# Altium schematic sheet XMOD_Thermal.SchDoc
size A4
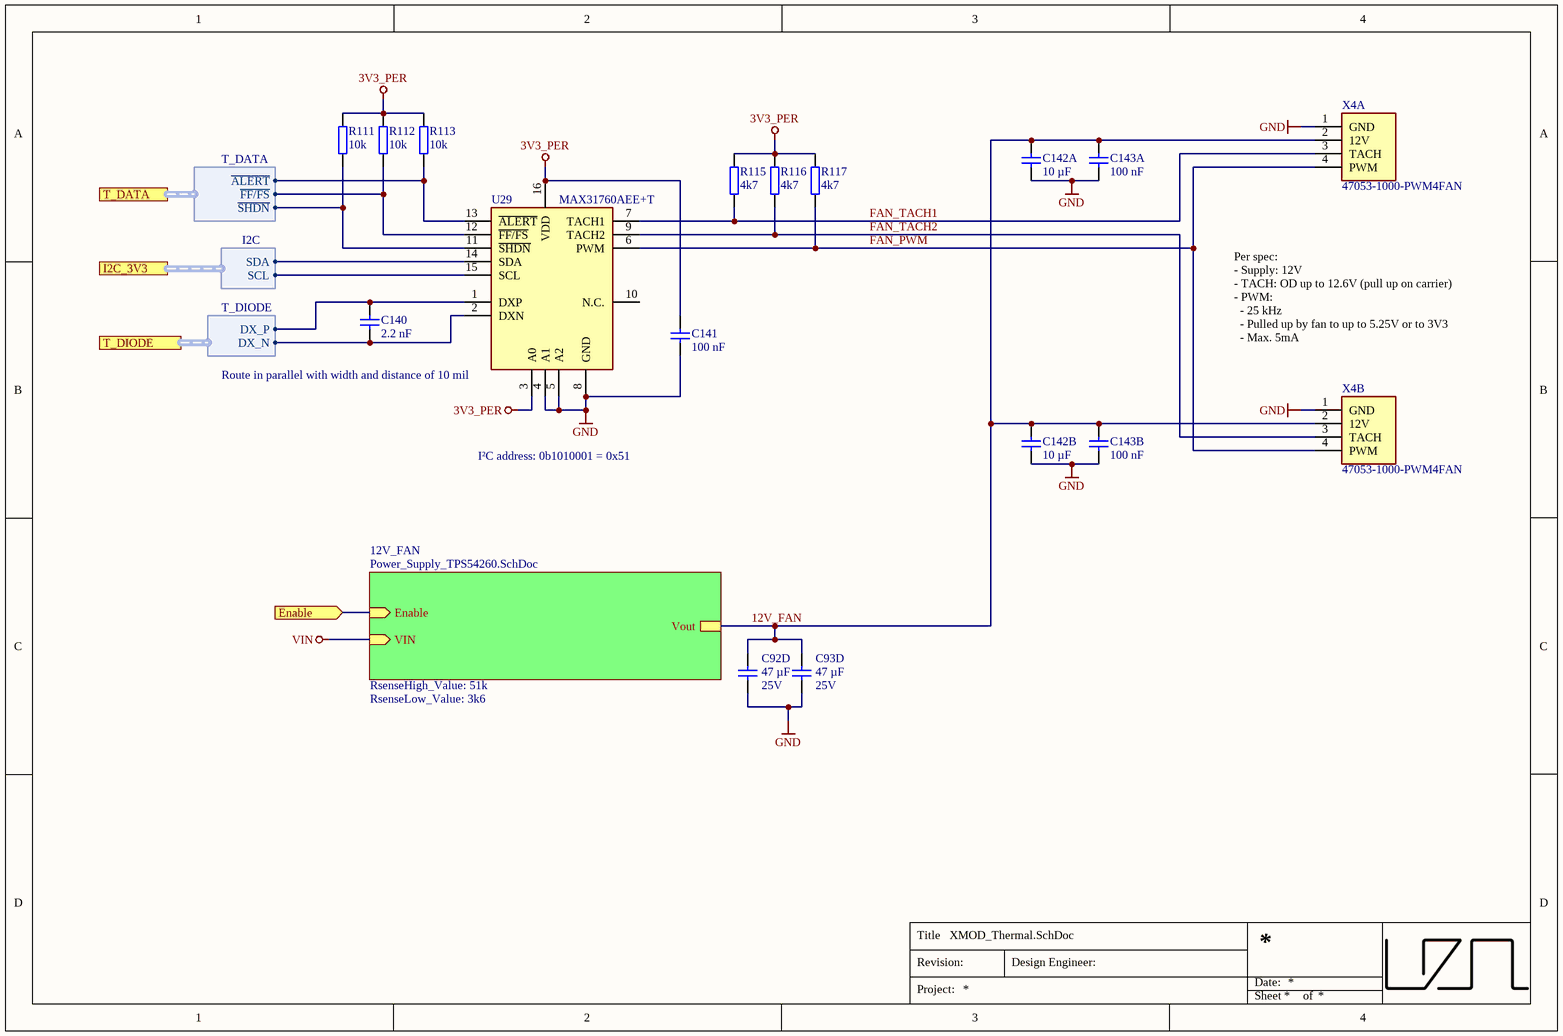
[diagram p0: XMOD_Thermal.SchDoc]

## Parts
C92D  47 µF  Voltage: 25V  [C_1206_TE]
C93D  47 µF  Voltage: 25V  [C_1206_TE]
C140  2.2 nF  [C_0603_TE]
C141  100 nF  [C_0603_TE]
C142A  10 µF  [C_1206_TE]
C142B  10 µF  [C_1206_TE]
C143A  100 nF  [C_0603_TE]
C143B  100 nF  [C_0603_TE]
R111  10k  [R_0603_TE]
R112  10k  [R_0603_TE]
R113  10k  [R_0603_TE]
R115  4k7  [R_0603_TE]
R116  4k7  [R_0603_TE]
R117  4k7  [R_0603_TE]
U29  MAX31760AEE+T  [SOP64P602X175-16N]
X4A  47053-1000-PWM4FAN  [470531000]
X4B  47053-1000-PWM4FAN  [470531000]

## Sub-sheets
12V_FAN = Power_Supply_TPS54260.SchDoc: Vout, Enable (in), VIN (in)  | RsenseHigh_Value: 51k; RsenseHigh_MPN: UZgen_R_0603_51k; RsenseLow_Value: 3k6; RsenseLow_MPN: UZgen_R_0603_3k6

## Ports
Enable (in), I2C_3V3 (harness I2C), T_DATA (harness T_DATA), T_DIODE (harness T_DIODE)

## Harnesses
I2C: SCL, SDA
T_DIODE: DX_P, DX_N
T_DATA: ~{ALERT}, ~{FF/FS}, ~{SHDN}

## Nets
3V3_PER: C141.2 R111.2 R112.2 R113.2 R115.2 R116.2 R117.2 U29.3(A0) U29.16(VDD)
GND: C92D.1 C93D.1 C141.1 C142A.1 C142B.1 C143A.1 C143B.1 U29.4(A1) U29.5(A2) U29.8(GND) X4A.1(GND) X4B.1(GND)
VIN: sheet 12V_FAN/VIN
12V_FAN: C92D.2 C93D.2 C142A.2 C142B.2 C143A.2 C143B.2 X4A.2(12V) X4B.2(12V) ; sheet 12V_FAN/Vout
Enable: port Enable, sheet 12V_FAN/Enable
FAN_PWM: R117.1 U29.6(PWM) X4A.4(PWM) X4B.4(PWM)
FAN_TACH1: R115.1 U29.7(TACH1) X4A.3(TACH)
FAN_TACH2: R116.1 U29.9(TACH2) X4B.3(TACH)
NetC140_1: C140.1 U29.2(DXN) ; port T_DIODE.DX_N
NetC140_2: C140.2 U29.1(DXP) ; port T_DIODE.DX_P
NetR111_1: R111.1 U29.11(~{SHDN}) ; port T_DATA.~{SHDN}
NetR112_1: R112.1 U29.12(~{FF/FS}) ; port T_DATA.~{FF/FS}
NetR113_1: R113.1 U29.13(~{ALERT}) ; port T_DATA.~{ALERT}
NetU29_14: U29.14(SDA) ; port I2C_3V3.SDA
NetU29_15: U29.15(SCL) ; port I2C_3V3.SCL

Not connected (* = marked no-connect by the designer): U29 10(N.C.)

## Notes on the sheet
- (near U29) Route in parallel with width and distance of 10 mil
- Per spec:
  - Supply: 12V
  - TACH: OD up to 12.6V (pull up on carrier)
  - PWM:
  - 25 kHz
  - Pulled up by fan to up to 5.25V or to 3V3
  - Max. 5mA
- I²C address: 0b1010001 = 0x51
- Title
- Revision:
- Design Engineer:
- Date:
- Project:
- Sheet
- of

## Library data of the parts
C92D C93D = UZgen_C_1206_47uF_25V_X7R: Generic capacitor; Manufacturer: UZgen; Tolerance: 10 %; Created from: UZgenTool; Value: 47 µF; Technology: X7R; Manufacturer Part Number: UZgen_C_1206_47uF_25V_X7R; PartID: 5224; Created On: 02/08/2024 11:18:30; Device Package: 1206; Mounting Type: SMD; Last Updated: 02/08/2024 11:18:30
C140 = UZgen_C_0603_2.2nF_50V_X7R: Generic capacitor; Manufacturer: UZgen; Voltage: 50V; Tolerance: 10 %; Created from: UZgenTool; Manufacturer Part Number: UZgen_C_0603_2.2nF_50V_X7R; PartID: 4247; Created On: 02/08/2024 11:18:09; Value: 2.2 nF; Device Package: 0603; Technology: X7R; Mounting Type: SMD; Last Updated: 02/08/2024 11:18:09
C141 C143A C143B = UZgen_C_0603_100nF_50V_X7R: Generic capacitor; Manufacturer: UZgen; Voltage: 50V; Tolerance: 10 %; Created from: AGeiger; Manufacturer Part Number: UZgen_C_0603_100nF_50V_X7R; PartID: 1; Created On: 02/07/2024 14:42:23; Value: 100 nF; Device Package: 0603; Technology: X7R; Mounting Type: SMD; Last Updated: 08/08/2024 15:01:15
C142A C142B = CL31B106KBHNNNE: 50V 10uF X7R ±10% 1206  Multilayer Ceramic Capacitors MLCC - SMD/SMT ROHS; Manufacturer: Samsung Electro-Mechanics; Voltage Rating: 50 VDC; Created from: AGeiger; Manufacturer Part Number: CL31B106KBHNNNE; PartID: 107; Created On: 20/09/2022 20:14:50; ComponentLink1Description: Datasheet; ComponentLink1URL: https://datasheet.lcsc.com/lcsc/1810221111_Samsung-Electro-Mechanics-CL31B106KBHNNNE_C89632.pdf; Component Type: Capacitor 1206; Device Package: 1206; Last Updated: 08/08/2024 12:57:34; Mounting Type: SMD; Operating Temperature: -55 - 125°C; Series: X7R; Supplier 1: LCSC; Supplier Part Number 1: C89632; Supplier 2: Mouser; Supplier Part Number 2: 187-CL31B106KBHNNNE; Type: Capacitor; Tolerance: 10 %; Value: 10 µF; Live Cycle Status: 1; LCSC Part Number: C89632
R111-R113 = UZgen_R_0603_10k: Generic resistor; Manufacturer: UZgen; Tolerance: 1 %; Created from: AGeiger; Manufacturer Part Number: UZgen_R_0603_10k; PartID: 1; Created On: 02/07/2024 14:34:53; Value: 10k; Device Package: 0603; Mounting Type: SMD; Last Updated: 02/07/2024 14:37:16
R115-R117 = UZgen_R_0603_4k7: Generic resistor; Manufacturer: UZgen; Tolerance: 1 %; Created from: UZgenTool; Manufacturer Part Number: UZgen_R_0603_4k7; PartID: 237; Created On: 02/07/2024 17:29:50; Value: 4k7; Device Package: 0603; Mounting Type: SMD; Last Updated: 02/07/2024 17:29:50
U29 = MAX31760AEE+T: Motor/Motion/Ignition Controllers & Drivers Fan Speed Controller with LUT t&r; Manufacturer: Analog Devices Inc.; Created from: FRosner; Manufacturer Part Number: MAX31760AEE+T; PartID: 18; Created On: 02/07/2024 15:15:09; ComponentLink1Description: Datasheet; ComponentLink1URL: https://www.analog.com/media/en/technical-documentation/data-sheets/MAX31760.pdf; Component Type: Fan Controller; Device Package: QSOP-16; Last Updated: 04/09/2024 11:48:15; Mounting Type: SMD/SMT; Operating Temperature: -40 - 125 °C; Series: MAX31760; Supplier 1: Mouser; Supplier Part Number 1: 700-MAX31760AEE+T; Supplier 2: LCSC; Supplier Part Number 2: C3031567; Type: Driver; Live Cycle Status: 1; LCSC Part Number: C3031567; Stock number: not stored
X4A X4B = 47053-1000-PWM4FAN: Headers & Wire Housings 4P VERT HDR W/FL; Manufacturer_Name: Molex; Created from: FRosner; Number of positions: 4; Datasheet Link: http://www.molex.com/pdm_docs/sd/470531000_sd.pdf; Height: 8mm; Manufacturer_Part_Number: 47053-1000; Mouser Part Number: 538-47053-1000; Mouser Price/Stock: https://www.mouser.co.uk/ProductDetail/Molex/47053-1000?qs=ph4zPCVRuvqoDX7hrEhxNA%3D%3D; Manufacturer Part Number: 47053-1000-PWM4FAN; PartID: 17; Created On: 21/08/2024 08:09:57; ComponentLink1Description: Datasheet; ComponentLink1URL: https://tools.molex.com/pdm_docs/sd/470531000_sd.pdf; Component Type: Pin Header; Device Package: THT; Last Updated: 04/09/2024 14:33:45; Manufacturer: Molex; Mounting Type: THT; Series: 47053; Supplier 1: Mouser; Supplier Part Number 1: 538-47053-1000; Supplier 2: LCSC; Supplier Part Number 2: C240840; Type: Pin Header; Live Cycle Status: 1; LCSC Part Number: C240840; Stock number: not stored; Number of rows: 1